# EAGLE design 6809 (EAGLE 7.4.0)

## Sheet 1 of 2
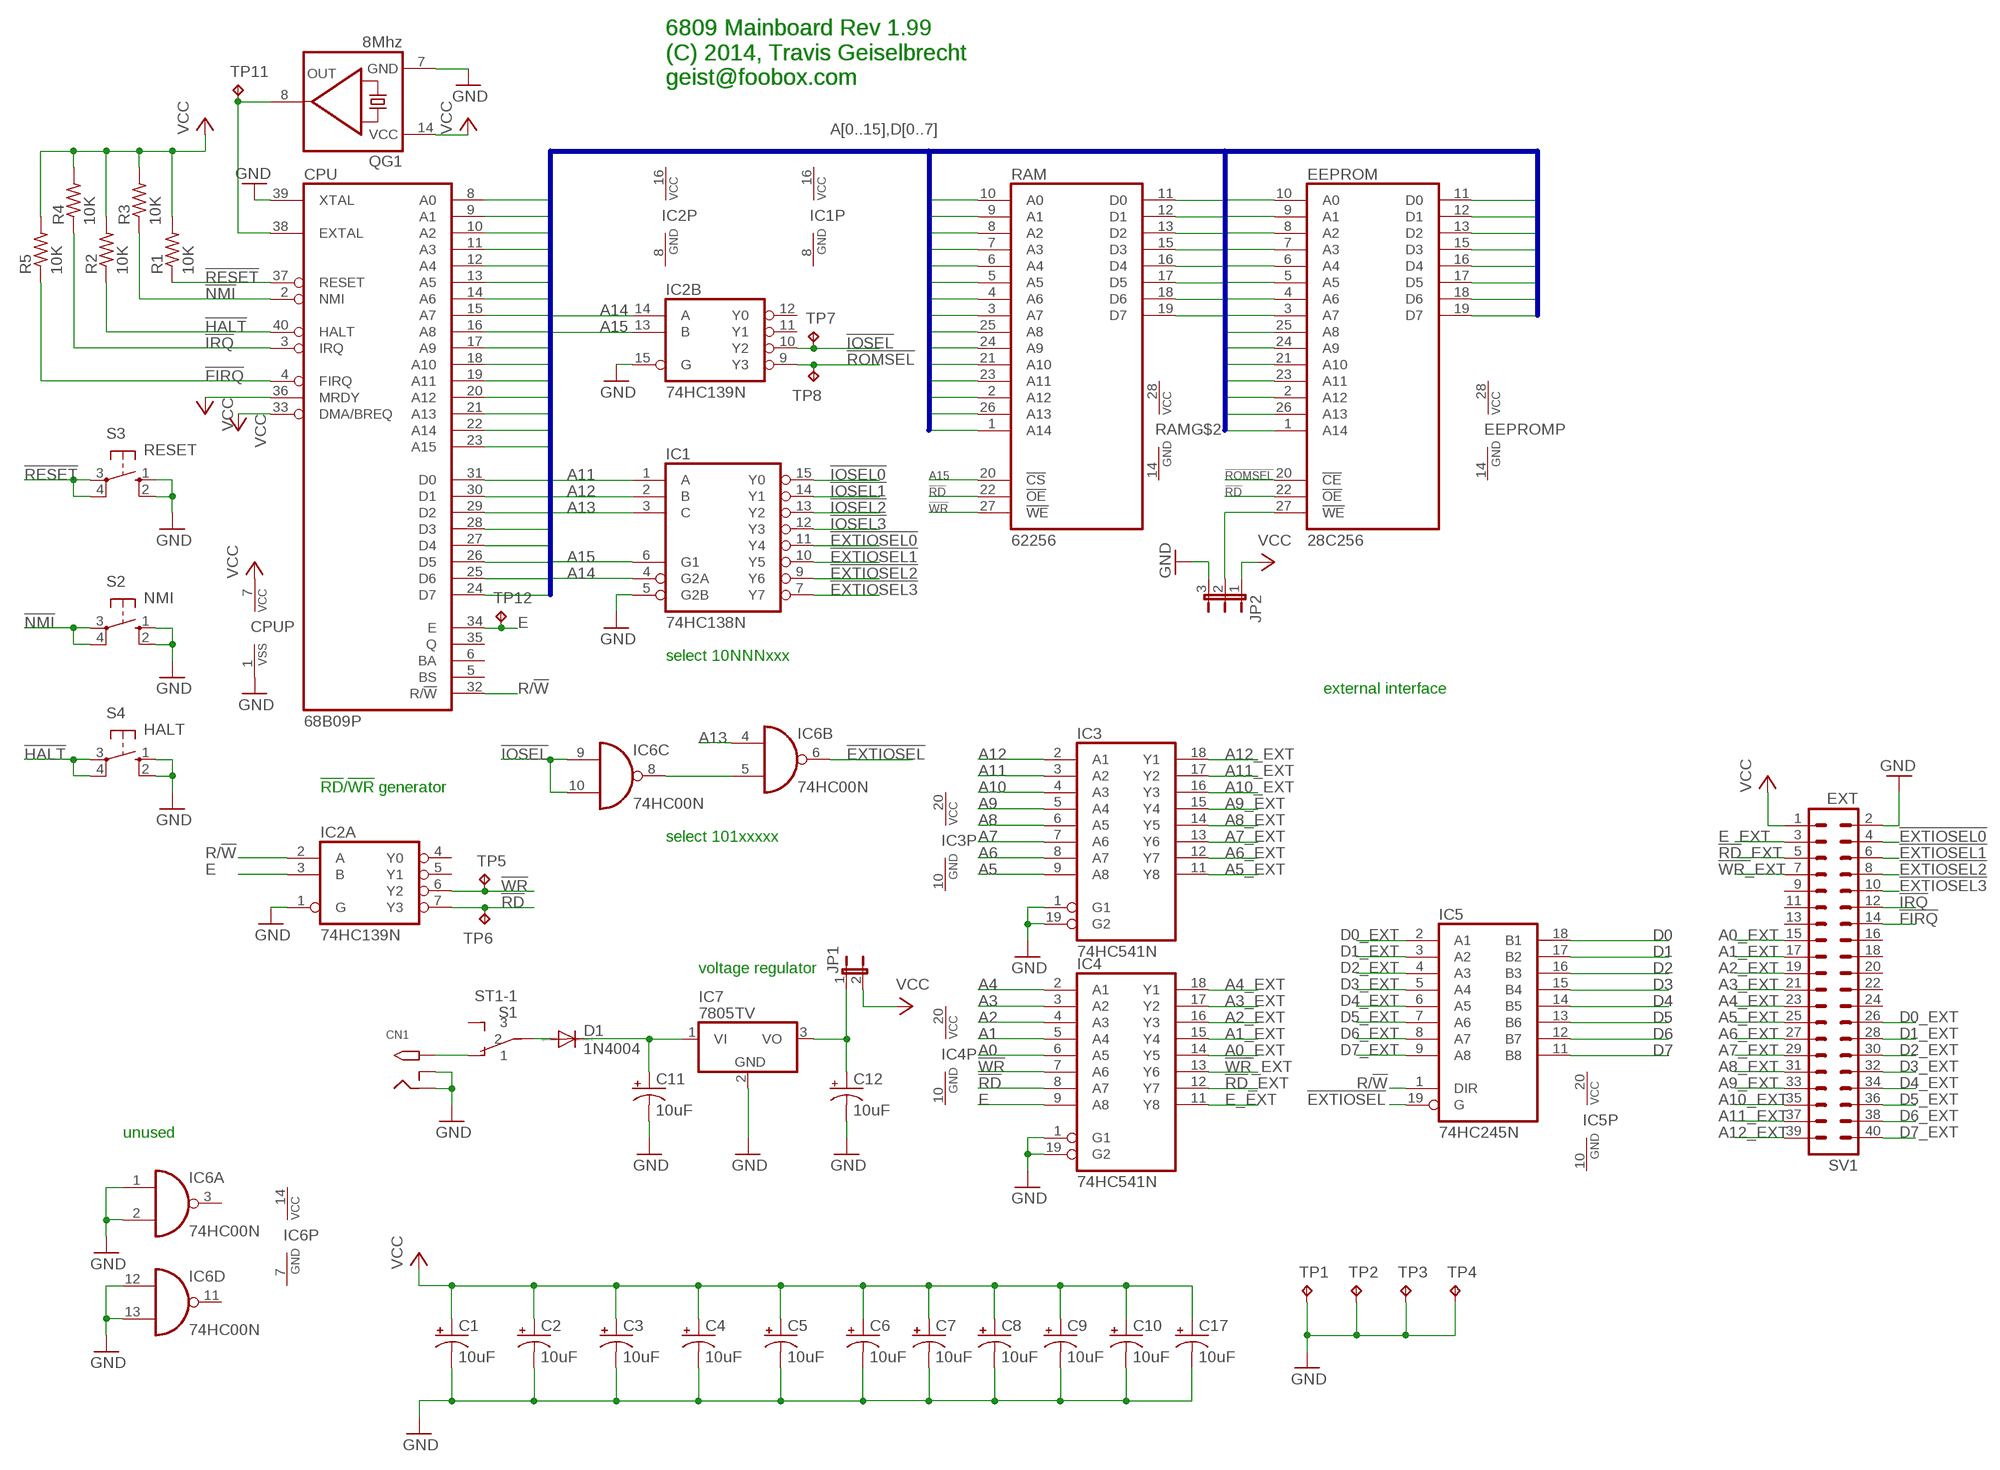
[diagram p0: schematic, sheet 1]

### Parts
C1  10uF  CPOL-USE1.8-4  [E1,8-4]
C2  10uF  CPOL-USE1.8-4  [E1,8-4]
C3  10uF  CPOL-USE1.8-4  [E1,8-4]
C4  10uF  CPOL-USE1.8-4  [E1,8-4]
C5  10uF  CPOL-USE1.8-4  [E1,8-4]
C6  10uF  CPOL-USE1.8-4  [E1,8-4]
C7  10uF  CPOL-USE1.8-4  [E1,8-4]
C8  10uF  CPOL-USE1.8-4  [E1,8-4]
C9  10uF  CPOL-USE1.8-4  [E1,8-4]
C10  10uF  CPOL-USE1.8-4  [E1,8-4]
C11  10uF  CPOL-USE1.8-4  [E1,8-4]
C12  10uF  CPOL-USE1.8-4  [E1,8-4]
C17  10uF  CPOL-USE1.8-4  [E1,8-4]
CN1  2.1MMJACKTHM  [PJ-102A]
CPU  68B09P  6809  [DIL40]
D1  1N4004  [DO41-10]
EEPROM  28C256  [DIL28]
IC1  74HC138N  [DIL16]
IC2  74HC139N  [DIL16]
IC3  74HC541N  [DIL20]
IC4  74HC541N  [DIL20]
IC5  74HC245N  [DIL20]
IC6  74HC00N  [DIL14]
IC7  7805TV  [TO220V]
JP1  JP1E  [JP1]
JP2  JP2E  [JP2]
QG1  8Mhz  QG5860  [DIL14S]
R1  10K  R-US_0207/10  [0207/10]
R2  10K  R-US_0207/10  [0207/10]
R3  10K  R-US_0207/10  [0207/10]
R4  10K  R-US_0207/10  [0207/10]
R5  10K  R-US_0207/10  [0207/10]
RAM  62256  [DIL28]
S1  ST1-1  [ST1-1]
S2  NMI  10-XX  [B3F-10XX]
S3  RESET  10-XX  [B3F-10XX]
S4  HALT  10-XX  [B3F-10XX]
SV1  EXT  MA20-2  [MA20-2]
TP1  TPPAD1-13  [P1-13]
TP2  TPPAD1-13  [P1-13]
TP3  TPPAD1-13  [P1-13]
TP4  TPPAD1-13  [P1-13]
TP5  TPTP10R  [TP10R]
TP6  TPTP10R  [TP10R]
TP7  TPTP10R  [TP10R]
TP8  TPTP10R  [TP10R]
TP11  TPTP10R  [TP10R]
TP12  TPTP10R  [TP10R]

### Nets
!EXTIOSEL: IC5.19(G) IC6.6(B:O)
!EXTIOSEL0: IC1.11(Y4) SV1.4
!EXTIOSEL1: IC1.10(Y5) SV1.6
!EXTIOSEL2: IC1.9(Y6) SV1.8
!EXTIOSEL3: IC1.7(Y7) SV1.10
!FIRQ: CPU.4(FIRQ) R5.1 SV1.14
!HALT: CPU.40(HALT) R2.1 S4.3(P) S4.4(P1)
!IOSEL: IC2.10(B:Y2) IC6.9(C:I0) IC6.10(C:I1) TP7.TP
!IOSEL0: IC1.15(Y0) ; also sheet 2
!IOSEL1: IC1.14(Y1)
!IOSEL2: IC1.13(Y2)
!IOSEL3: IC1.12(Y3)
!IRQ: CPU.3(IRQ) R4.1 SV1.12 ; also sheet 2
!NMI: CPU.2(NMI) R3.1 S2.3(P) S2.4(P1)
!RD: EEPROM.22(!OE) IC2.7(A:Y3) IC4.8(A7) RAM.22(!OE) TP6.TP ; also sheet 2
!RD!_EXT: IC4.12(Y7) SV1.5
!RESET: CPU.37(RESET) R1.1 S3.3(P) S3.4(P1)
!ROMSEL: EEPROM.20(!CE) IC2.9(B:Y3) TP8.TP
!WR: IC2.6(A:Y2) IC4.7(A6) RAM.27(!WE) TP5.TP ; also sheet 2
!WR!_EXT: IC4.13(Y6) SV1.7
A0: CPU.8(A0) EEPROM.10(A0) IC4.6(A5) RAM.10(A0) ; also sheet 2
A0_EXT: IC4.14(Y5) SV1.15
A1: CPU.9(A1) EEPROM.9(A1) IC4.5(A4) RAM.9(A1) ; also sheet 2
A1_EXT: IC4.15(Y4) SV1.17
A2: CPU.10(A2) EEPROM.8(A2) IC4.4(A3) RAM.8(A2) ; also sheet 2
A2_EXT: IC4.16(Y3) SV1.19
A3: CPU.11(A3) EEPROM.7(A3) IC4.3(A2) RAM.7(A3)
A3_EXT: IC4.17(Y2) SV1.21
A4: CPU.12(A4) EEPROM.6(A4) IC4.2(A1) RAM.6(A4)
A4_EXT: IC4.18(Y1) SV1.23
A5: CPU.13(A5) EEPROM.5(A5) IC3.9(A8) RAM.5(A5)
A5_EXT: IC3.11(Y8) SV1.25
A6: CPU.14(A6) EEPROM.4(A6) IC3.8(A7) RAM.4(A6)
A6_EXT: IC3.12(Y7) SV1.27
A7: CPU.15(A7) EEPROM.3(A7) IC3.7(A6) RAM.3(A7)
A7_EXT: IC3.13(Y6) SV1.29
A8: CPU.16(A8) EEPROM.25(A8) IC3.6(A5) RAM.25(A8)
A8_EXT: IC3.14(Y5) SV1.31
A9: CPU.17(A9) EEPROM.24(A9) IC3.5(A4) RAM.24(A9)
A9_EXT: IC3.15(Y4) SV1.33
A10: CPU.18(A10) EEPROM.21(A10) IC3.4(A3) RAM.21(A10)
A10_EXT: IC3.16(Y3) SV1.35
A11: CPU.19(A11) EEPROM.23(A11) IC1.1(A) IC3.3(A2) RAM.23(A11)
A11_EXT: IC3.17(Y2) SV1.37
A12: CPU.20(A12) EEPROM.2(A12) IC1.2(B) IC3.2(A1) RAM.2(A12)
A12_EXT: IC3.18(Y1) SV1.39
A13: CPU.21(A13) EEPROM.26(A13) IC1.3(C) IC6.4(B:I0) RAM.26(A13)
A14: CPU.22(A14) EEPROM.1(A14) IC1.4(G2A) IC2.14(B:A) RAM.1(A14)
A15: CPU.23(A15) IC1.6(G1) IC2.13(B:B) RAM.20(!CS)
D0: CPU.31(D0) EEPROM.11(D0) IC5.18(B1) RAM.11(D0) ; also sheet 2
D0_EXT: IC5.2(A1) SV1.26
D1: CPU.30(D1) EEPROM.12(D1) IC5.17(B2) RAM.12(D1) ; also sheet 2
D1_EXT: IC5.3(A2) SV1.28
D2: CPU.29(D2) EEPROM.13(D2) IC5.16(B3) RAM.13(D2) ; also sheet 2
D2_EXT: IC5.4(A3) SV1.30
D3: CPU.28(D3) EEPROM.15(D3) IC5.15(B4) RAM.15(D3) ; also sheet 2
D3_EXT: IC5.5(A4) SV1.32
D4: CPU.27(D4) EEPROM.16(D4) IC5.14(B5) RAM.16(D4) ; also sheet 2
D4_EXT: IC5.6(A5) SV1.34
D5: CPU.26(D5) EEPROM.17(D5) IC5.13(B6) RAM.17(D5) ; also sheet 2
D5_EXT: IC5.7(A6) SV1.36
D6: CPU.25(D6) EEPROM.18(D6) IC5.12(B7) RAM.18(D6) ; also sheet 2
D6_EXT: IC5.8(A7) SV1.38
D7: CPU.24(D7) EEPROM.19(D7) IC5.11(B8) RAM.19(D7) ; also sheet 2
D7_EXT: IC5.9(A8) SV1.40
E: CPU.34(E) IC2.3(A:B) IC4.9(A8) TP12.TP
E_EXT: IC4.11(Y8) SV1.3
GND [power]: C1.- C2.- C3.- C4.- C5.- C6.- C7.- C8.- C9.- C10.- C11.- C12.- C17.- CN1.RING CN1.RING_SW CPU.1(VSS) CPU.39(XTAL) IC1.5(G2B) IC2.1(A:G) IC2.15(B:G) IC3.1(G1) IC3.19(G2) IC4.1(G1) IC4.19(G2) IC6.1(A:I0) IC6.2(A:I1) IC6.12(D:I0) IC6.13(D:I1) IC7.2(GND) JP2.3 QG1.7(GND) S2.1(S) S2.2(S1) S3.1(S) S3.2(S1) S4.1(S) S4.2(S1) SV1.2 TP1.TP TP2.TP TP3.TP TP4.TP ; also sheet 2
N$3: C11.+ D1.C IC7.1(VI)
N$4: IC6.5(B:I1) IC6.8(C:O)
N$5: CN1.TIP S1.P$1
N$13: CPU.38(EXTAL) QG1.8(OUT) TP11.TP
N$15: D1.A S1.P$2
N$25: EEPROM.27(!WE) JP2.2
N$26: C12.+ IC7.3(VO) JP1.1
R/!W: CPU.32(R/!W) IC2.2(A:A) IC5.1(DIR)
VCC [power]: C1.+ C2.+ C3.+ C4.+ C5.+ C6.+ C7.+ C8.+ C9.+ C10.+ C17.+ CPU.7(VCC) CPU.33(DMA/BREQ) CPU.36(MRDY) JP1.2 JP2.1 QG1.14(VCC) R1.2 R2.2 R3.2 R4.2 R5.2 SV1.1 ; also sheet 2
Unconnected: CPU.5(BS) CPU.6(BA) CPU.35(Q) IC2.4(A:Y0) IC2.5(A:Y1) IC2.11(B:Y1) IC2.12(B:Y0) IC6.3(A:O) IC6.11(D:O) S1.P$3 SV1.9 SV1.11 SV1.13 SV1.16 SV1.18 SV1.20 SV1.22 SV1.24

### Buses
A[0..15],D[0..7]

### Notes on the sheet
- 6809 Mainboard Rev 1.99
  (C) 2014, Travis Geiselbrecht
  geist@foobox.com
- 6809 Mainboard Rev 1
  (C) 2014, Travis Geiselbrecht
  geist@foobox.com
- select 10NNNxxx
- external interface
- !RD!/!WR! generator
- select 101xxxxx
- voltage regulator
- unused

## Sheet 2 of 2
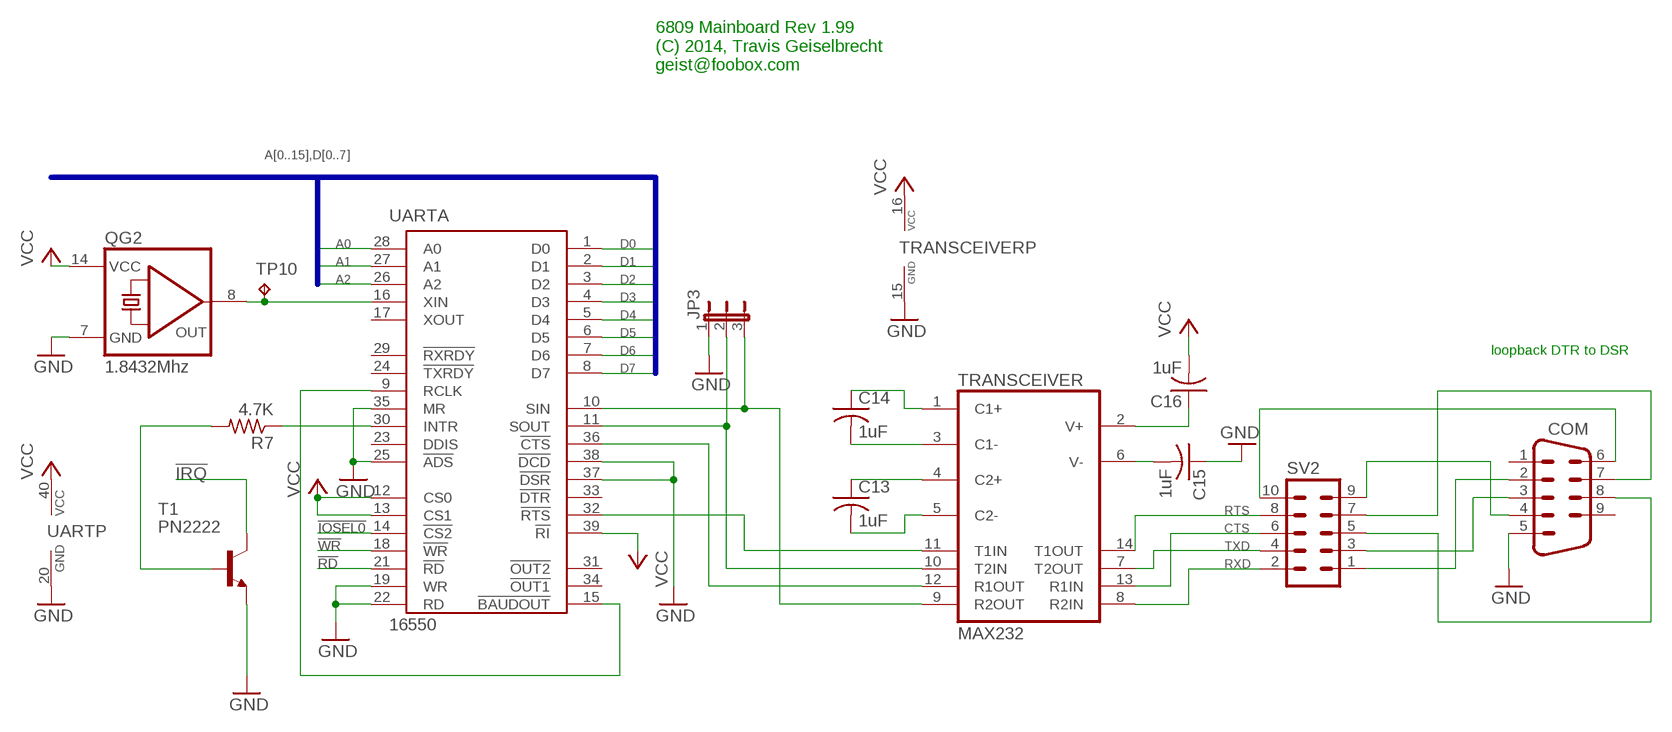
[diagram p1: schematic, sheet 2]

### Parts
C13  1uF  C-US025-025X050  [C025-025X050]
C14  1uF  C-US025-025X050  [C025-025X050]
C15  1uF  C-US025-025X050  [C025-025X050]
C16  1uF  C-US025-025X050  [C025-025X050]
COM  M09HP  [M09HP]
JP3  JP2E  [JP2]
QG2  1.8432Mhz  QG5860  [DIL14S]
R7  4.7K  R-US_0207/10  [0207/10]
SV2  MA05-2  [MA05-2]
T1  PN2222  2N2222  [TO92-EBC-OVAL]
TP10  TPTP10R  [TP10R]
TRANSCEIVER  MAX232  [DIL16]
UART  16550  [DIL40]

### Nets
!IOSEL0: UART.14(A:!CS2) ; also sheet 1
!IRQ: T1.C ; also sheet 1
!RD: UART.21(A:!RD) ; also sheet 1
!WR: UART.18(A:!WR) ; also sheet 1
A0: UART.28(A:A0) ; also sheet 1
A1: UART.27(A:A1) ; also sheet 1
A2: UART.26(A:A2) ; also sheet 1
CTS: SV2.6 TRANSCEIVER.13(R1IN)
D0: UART.1(A:D0) ; also sheet 1
D1: UART.2(A:D1) ; also sheet 1
D2: UART.3(A:D2) ; also sheet 1
D3: UART.4(A:D3) ; also sheet 1
D4: UART.5(A:D4) ; also sheet 1
D5: UART.6(A:D5) ; also sheet 1
D6: UART.7(A:D6) ; also sheet 1
D7: UART.8(A:D7) ; also sheet 1
GND [power]: C15.1 COM.5 JP3.1 QG2.7(GND) T1.E TRANSCEIVER.15(GND) UART.19(A:WR) UART.20(P:GND) UART.22(A:RD) UART.25(A:!ADS) UART.35(A:MR) UART.37(A:!DSR) UART.38(A:!DCD) ; also sheet 1
N$1: QG2.8(OUT) TP10.TP UART.16(A:XIN)
N$2: TRANSCEIVER.11(T1IN) UART.32(A:!RTS)
N$6: JP3.2 TRANSCEIVER.10(T2IN) UART.11(A:SOUT)
N$7: TRANSCEIVER.12(R1OUT) UART.36(A:!CTS)
N$8: COM.4 SV2.9
N$9: C14.1 TRANSCEIVER.1(C1+)
N$10: C14.2 TRANSCEIVER.3(C1-)
N$11: JP3.3 TRANSCEIVER.9(R2OUT) UART.10(A:SIN)
N$12: C13.1 TRANSCEIVER.4(C2+)
N$14: C13.2 TRANSCEIVER.5(C2-)
N$16: COM.2 SV2.1
N$17: COM.8 SV2.5
N$18: COM.7 SV2.7
N$19: C16.1 TRANSCEIVER.2(V+)
N$20: COM.3 SV2.3
N$21: C15.2 TRANSCEIVER.6(V-)
N$22: R7.2 T1.B
N$23: R7.1 UART.30(A:INTR)
N$24: COM.6 SV2.10
N$27: UART.9(A:RCLK) UART.15(A:!BAUDOUT)
RTS: SV2.8 TRANSCEIVER.14(T1OUT)
RXD: SV2.2 TRANSCEIVER.8(R2IN)
TXD: SV2.4 TRANSCEIVER.7(T2OUT)
VCC [power]: C16.2 QG2.14(VCC) TRANSCEIVER.16(VCC) UART.12(A:CS0) UART.13(A:CS1) UART.39(A:!RI) UART.40(P:VCC) ; also sheet 1
Unconnected: COM.1 COM.9 UART.17(A:XOUT) UART.23(A:DDIS) UART.24(A:!TXRDY) UART.29(A:!RXRDY) UART.31(A:!OUT2) UART.33(A:!DTR) UART.34(A:!OUT1)

### Buses
A[0..15],D[0..7]

### Notes on the sheet
- 6809 Mainboard Rev 1.99
  (C) 2014, Travis Geiselbrecht
  geist@foobox.com
- loopback DTR to DSR

## Power pins joined to a net without a drawn wire
GND: EEPROM.14(GND) IC1.8(GND) IC2.8(P:GND) IC3.10(GND) IC4.10(GND) IC5.10(GND) IC6.7(P:GND) RAM.14(GND)
VCC: EEPROM.28(VCC) IC1.16(VCC) IC2.16(P:VCC) IC3.20(VCC) IC4.20(VCC) IC5.20(VCC) IC6.14(P:VCC) RAM.28(VCC)

## Library data of the parts
C1-C12 C17 = adafruit:CPOL-US: POLARIZED CAPACITOR, American symbol
C13-C16 = resistor:C-US: CAPACITOR, American symbol
CN1 = adafruit:2.1MMJACK: 2.1mm x 5.5mm THM DC jack with internal switch. Digikey part #PJ-102A, 4UCON part #05537 2.1mm x 5.5mm SMT DC jack with internal switch. Digikey part #PJ-002A-SMT, 4UCON part #03267 By microbuilder.eu & adafruit.com
COM = con-subd:M09: SUB-D; OC_FARNELL: unknown; OC_NEWARK: unknown
CPU = micro-motorola:6809: MICROCONTROLLER/MEMORY DEVICE; MF: NTE ELECTRONICS; MPN: NTE6809; OC_FARNELL: 4530354; OC_NEWARK: 31C2459
D1 = diode:1N4004: DIODE general purpose rectifier, 1 A
EEPROM = mystuff:28C256: 8K x 8 EEPROM
IC1 = 74xx-eu:74*138: 3-line to 8-line DECODER/DEMULTIPLEXER
IC2 = 74xx-eu:74*139: Dual 2-line to 4-line DECODER/DEMULTIPLEXER
IC3 IC4 = 74xx-eu:74*541: Octal BUFFER and LINE DRIVER, 3-state
IC5 = 74xx-eu:74*245: Octal BUS TRANSCEIVER, 3-state
IC6 = 74xx-eu:74*00: Quad 2-input NAND gate
IC7 = linear:78*: Positive VOLTAGE REGULATOR Source: http://cache.national.com/ds/LM/LM78L05.pdf http://www.fairchildsemi.com/ds/LM/LM7805.pdf
JP1 = jumper:JP1E: JUMPER
JP2 JP3 = jumper:JP2E: JUMPER
QG1 QG2 = crystal:QG5860: CRYSTAL RESONATOR; OC_FARNELL: unknown; OC_NEWARK: unknown
R1-R5 R7 = resistor:R-US_: RESISTOR, American symbol
RAM = mystuff:62256: 32KB sram
S1 = mystuff:ST1-1
S2-S4 = switch-omron:10-XX: OMRON SWITCH; MPN: B3F-1000; OC_FARNELL: 176432; OC_NEWARK: 36M3542
SV1 = con-lstb:MA20-2: PIN HEADER; OC_FARNELL: unknown; OC_NEWARK: unknown
SV2 = con-lstb:MA05-2: PIN HEADER; OC_FARNELL: unknown; OC_NEWARK: unknown
T1 = adafruit:2N2222: NPN TRANSISTOR Big oval pads
TP1-TP8 TP10-TP12 = testpad:TP: Test pad
TRANSCEIVER = maxim:MAX232: RS232 TRANSCEIVER; MF: MAXIM; MPN: MAX232ACPE+; OC_FARNELL: 9723773; OC_NEWARK: 68K4544
UART = mystuff:16550

## Net classes
0 default: width 0.406 mm
1 power: width 1.016 mm

## Board
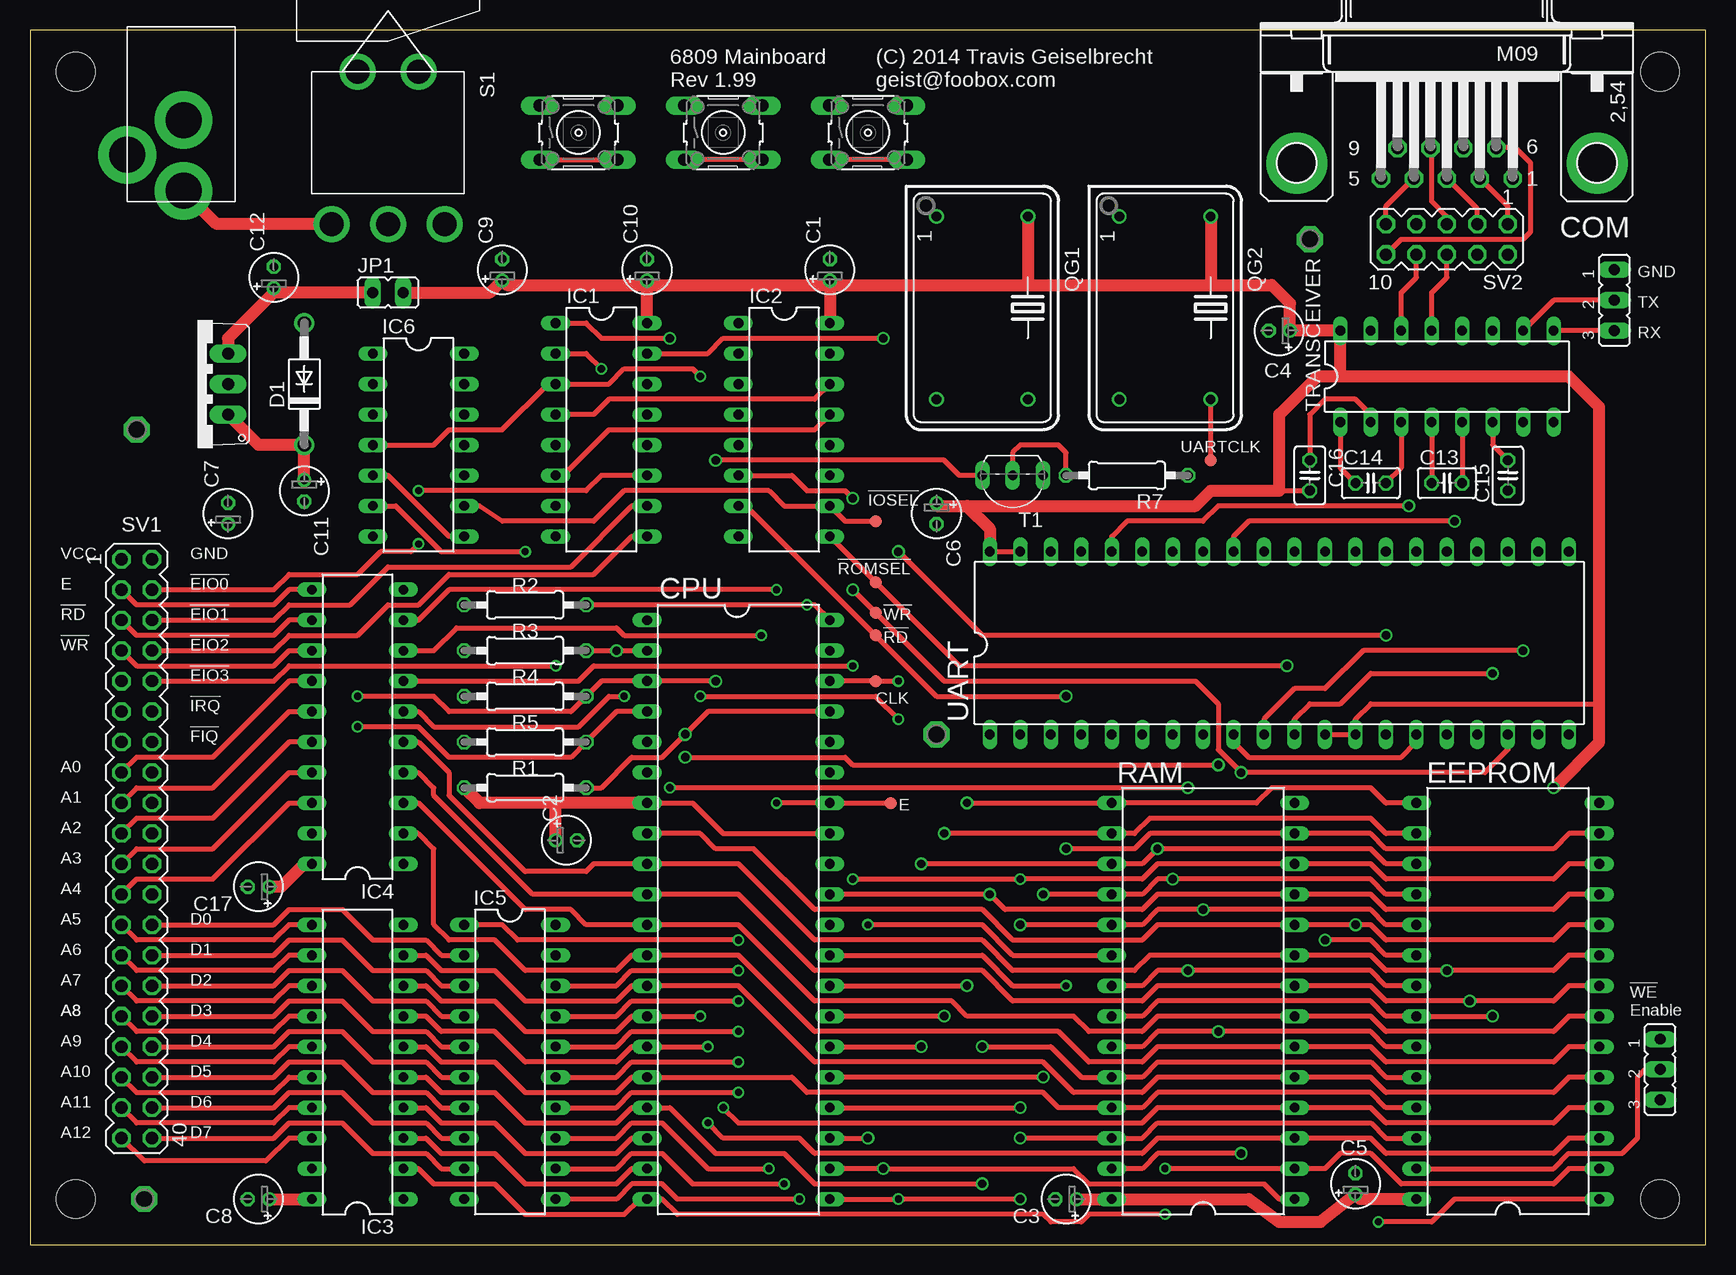
[diagram p2: board, top side]
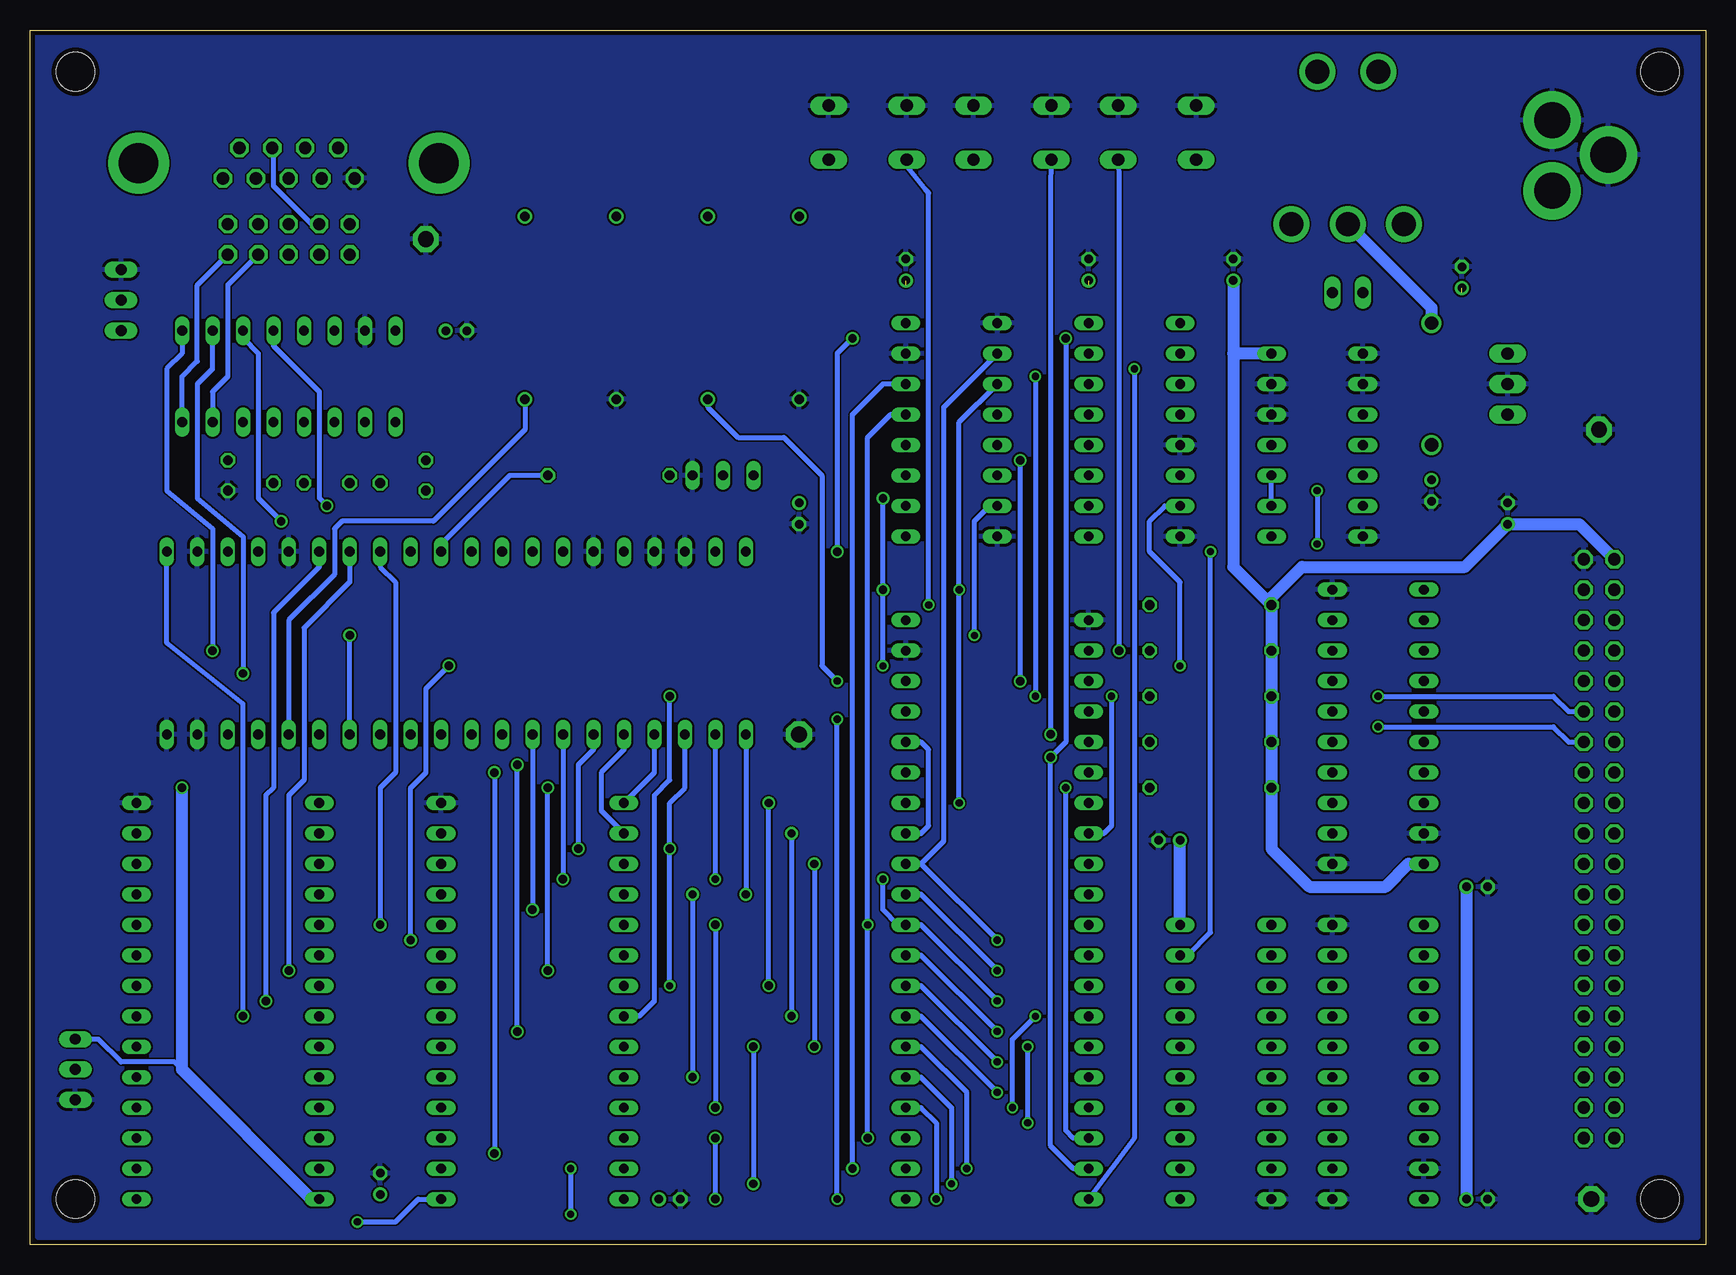
[diagram p3: board, bottom side, seen from below]

Size 139.68 x 101.27 mm. Coordinates in mm from the lower left corner, seen from the top.
Outline: 0,0 139.68,0 139.68,101.27 0,101.27 0,0
Copper layers (1*16): Top 0.0356mm / dielectric 1.5011mm / Bottom 0.0356mm
Design rules "oshpark": minimum track width 6mil, minimum drill 13mil, track to track 6mil, track to pad 6mil, pad to pad 6mil, via to via 6mil, smd to smd 6mil, copper to edge 15mil, drill to drill 6mil, minimum pad ring 7mil, minimum via ring 7mil, stop-mask expansion 3mil, vias tented up to drill 0mil, thermal gap 10mil
Holes 3.2 mm at 135.89,97.79 3.81,97.79 135.89,3.81 3.81,3.81

### Footprints (pad centres in the part's own frame; a part is rotated, then mirrored left to right if it is on the bottom)
E1,8-4 = drill 0.711 pad 1.168: + -0.889,0 | drill 0.711 pad 1.168 octagon: - 0.889,0
C025-025X050 = drill 0.813 octagon: 1 -1.27,0; 2 1.27,0
PJ-102A = drill 3 pad 4.8: RING 0.1,-3.39; RING_SW -4.6,-6.29; TIP 0.1,-9.29
M09HP = drill 1.016 octagon: 1 -5.486,1.27; 2 -2.743,1.27; 3 0,1.27; 4 2.743,1.27; 5 5.486,1.27; 6 -4.115,-1.27; 7 -1.372,-1.27; 8 1.372,-1.27; 9 4.115,-1.27 | drill 3.302 pad 5.08: G1 -12.522,0; G2 12.522,0
DIL40 = drill 0.813 long: 1 -24.13,-7.62; 2 -21.59,-7.62; 3 -19.05,-7.62; 4 -16.51,-7.62; 5 -13.97,-7.62; 6 -11.43,-7.62; 7 -8.89,-7.62; 8 -6.35,-7.62; 9 -3.81,-7.62; 10 -1.27,-7.62; 11 1.27,-7.62; 12 3.81,-7.62; 13 6.35,-7.62; 14 8.89,-7.62; 15 11.43,-7.62; 16 13.97,-7.62; 17 16.51,-7.62; 18 19.05,-7.62; 19 21.59,-7.62; 20 24.13,-7.62; 21 24.13,7.62; 22 21.59,7.62; 23 19.05,7.62; 24 16.51,7.62; 25 13.97,7.62; 26 11.43,7.62; 27 8.89,7.62; 28 6.35,7.62; 29 3.81,7.62; 30 1.27,7.62; 31 -1.27,7.62; 32 -3.81,7.62; 33 -6.35,7.62; 34 -8.89,7.62; 35 -11.43,7.62; 36 -13.97,7.62; 37 -16.51,7.62; 38 -19.05,7.62; 39 -21.59,7.62; 40 -24.13,7.62
DO41-10 = drill 1.118: A 5.08,0; C -5.08,0
DIL28 = drill 0.813 long: 1 -16.51,-7.62; 2 -13.97,-7.62; 3 -11.43,-7.62; 4 -8.89,-7.62; 5 -6.35,-7.62; 6 -3.81,-7.62; 7 -1.27,-7.62; 8 1.27,-7.62; 9 3.81,-7.62; 10 6.35,-7.62; 11 8.89,-7.62; 12 11.43,-7.62; 13 13.97,-7.62; 14 16.51,-7.62; 15 16.51,7.62; 16 13.97,7.62; 17 11.43,7.62; 18 8.89,7.62; 19 6.35,7.62; 20 3.81,7.62; 21 1.27,7.62; 22 -1.27,7.62; 23 -3.81,7.62; 24 -6.35,7.62; 25 -8.89,7.62; 26 -11.43,7.62; 27 -13.97,7.62; 28 -16.51,7.62
DIL16 = drill 0.813 long: 1 -8.89,-3.81; 2 -6.35,-3.81; 3 -3.81,-3.81; 4 -1.27,-3.81; 5 1.27,-3.81; 6 3.81,-3.81; 7 6.35,-3.81; 8 8.89,-3.81; 9 8.89,3.81; 10 6.35,3.81; 11 3.81,3.81; 12 1.27,3.81; 13 -1.27,3.81; 14 -3.81,3.81; 15 -6.35,3.81; 16 -8.89,3.81
DIL20 = drill 0.813 long: 1 -11.43,-3.81; 2 -8.89,-3.81; 3 -6.35,-3.81; 4 -3.81,-3.81; 5 -1.27,-3.81; 6 1.27,-3.81; 7 3.81,-3.81; 8 6.35,-3.81; 9 8.89,-3.81; 10 11.43,-3.81; 11 11.43,3.81; 12 8.89,3.81; 13 6.35,3.81; 14 3.81,3.81; 15 1.27,3.81; 16 -1.27,3.81; 17 -3.81,3.81; 18 -6.35,3.81; 19 -8.89,3.81; 20 -11.43,3.81
DIL14 = drill 0.813 long: 1 -7.62,-3.81; 2 -5.08,-3.81; 3 -2.54,-3.81; 4 0,-3.81; 5 2.54,-3.81; 6 5.08,-3.81; 7 7.62,-3.81; 8 7.62,3.81; 9 5.08,3.81; 10 2.54,3.81; 11 0,3.81; 12 -2.54,3.81; 13 -5.08,3.81; 14 -7.62,3.81
TO220V = drill 1.016 long: 1 -2.54,-2.54; 2 0,-2.54; 3 2.54,-2.54
JP1 = drill 0.914 long: 1 0,-1.27; 2 0,1.27
JP2 = drill 0.914 long: 1 -2.54,0; 2 0,0; 3 2.54,0
DIL14S = drill 0.813: 1 -7.62,-3.81; 7 7.62,-3.81; 8 7.62,3.81; 14 -7.62,3.81
0207/10 = drill 0.813 octagon: 1 -5.08,0; 2 5.08,0
ST1-1 = drill 2: P$1 0,-4.699; P$2 0,0; P$3 0,4.699; P$4 -12.7,2.54; P$5 -12.7,-2.54
B3F-10XX = drill 1.016 long: 1 -3.251,2.261; 2 3.251,2.261; 3 -3.251,-2.261; 4 3.251,-2.261
MA20-2 = drill 1.016 octagon: 1 -24.13,-1.27; 2 -24.13,1.27; 3 -21.59,-1.27; 4 -21.59,1.27; 5 -19.05,-1.27; 6 -19.05,1.27; 7 -16.51,-1.27; 8 -16.51,1.27; 9 -13.97,-1.27; 10 -13.97,1.27; 11 -11.43,-1.27; 12 -11.43,1.27; 13 -8.89,-1.27; 14 -8.89,1.27; 15 -6.35,-1.27; 16 -6.35,1.27; 17 -3.81,-1.27; 18 -3.81,1.27; 19 -1.27,-1.27; 20 -1.27,1.27; 21 1.27,-1.27; 22 1.27,1.27; 23 3.81,-1.27; 24 3.81,1.27; 25 6.35,-1.27; 26 6.35,1.27; 27 8.89,-1.27; 28 8.89,1.27; 29 11.43,-1.27; 30 11.43,1.27; 31 13.97,-1.27; 32 13.97,1.27; 33 16.51,-1.27; 34 16.51,1.27; 35 19.05,-1.27; 36 19.05,1.27; 37 21.59,-1.27; 38 21.59,1.27; 39 24.13,-1.27; 40 24.13,1.27
MA05-2 = drill 1.016 octagon: 1 -5.08,-1.27; 2 -5.08,1.27; 3 -2.54,-1.27; 4 -2.54,1.27; 5 0,-1.27; 6 0,1.27; 7 2.54,-1.27; 8 2.54,1.27; 9 5.08,-1.27; 10 5.08,1.27
TO92-EBC-OVAL = drill 0.813 long: B 0,-1.27; C 2.54,-1.27; E -2.54,-1.27
P1-13 = drill 1.321 pad 2.159 octagon: TP 0,0
TP10R = smd 1 x 1: TP 0,0

### Placement (x,y rotation side)
C1  66.67,81.28 90 top
C2  44.71,33.73 0 top
C3  86.36,3.81 180 top
C4  104.14,76.2 180 top
C5  110.49,5.08 90 top
C6  75.56,60.96 270 top
C7  16.51,60.96 90 top
C8  19.05,3.81 180 top
C9  39.37,81.28 90 top
C10  51.44,81.28 90 top
C11  22.86,62.87 270 top
C12  20.32,80.64 90 top
C13  118.11,63.5 0 top
C14  111.76,63.5 0 top
C15  123.19,64.14 90 top
C16  106.68,64.14 270 top
C17  19.05,29.84 180 top
CN1  12.7,97.16 0 top
COM  118.11,90.17 180 top
CPU  59.05,27.94 270 top
D1  22.86,71.75 90 top
EEPROM  123.19,20.32 90 top
IC1  47.62,67.94 270 top
IC2  62.87,67.94 270 top
IC3  27.3,15.24 90 top
IC4  27.3,43.18 90 top
IC5  40.01,15.24 270 top
IC6  32.38,66.67 270 top
IC7  13.97,71.75 90 top
JP1  29.84,79.38 270 top
JP2  135.89,14.61 270 top
JP3  132.08,78.74 270 top
QG1  79.38,78.11 270 top
QG2  94.61,78.11 270 top
R1  41.27,38.1 180 top
R2  41.27,53.34 180 top
R3  41.27,49.53 180 top
R4  41.27,45.72 180 top
R5  41.27,41.91 180 top
R7  91.44,64.14 180 top
RAM  97.79,20.32 90 top
S1  29.84,85.09 270 top
S2  45.72,92.71 0 top
S3  57.78,92.71 0 top
S4  69.85,92.71 0 top
SV1  8.89,33.02 270 top
SV2  118.11,83.82 180 top
T1  81.92,62.87 180 top
TP1  8.89,67.94 0 top
TP2  9.53,3.81 0 top
TP3  75.56,42.55 0 top
TP4  106.68,83.82 0 top
TP5  70.48,52.7 0 top
TP6  70.48,50.8 0 top
TP7  70.48,60.33 0 top
TP8  70.48,55.24 0 top
TP10  98.42,65.41 0 top
TP11  70.48,46.99 0 top
TP12  71.75,36.83 0 top
TRANSCEIVER  118.11,72.39 0 top
UART  104.14,50.16 0 top

### Tracks (layer width: path | path; a pad name or v marks a point on that pad's centre or on a via)
!EXTIOSEL  (via drill 0.6)
  Top 0.406: IC6.6 30.48,61.59 34.29,57.78 v41.27,57.78
  Bottom 0.406: IC5.19 43.18,24.13 41.27,26.04 v41.27,57.78
!EXTIOSEL0  (via drill 0.6)
  Top 0.406: SV1.4 20.32,54.61 21.59,55.88 27.3,55.88 29.21,57.78 31.75,57.78 v32.38,58.42 | IC1.11 47.62,64.14 46.35,62.87 v32.38,62.87
  Bottom 0.406: v32.38,62.87 v32.38,58.42
!EXTIOSEL1
  Top 0.406: SV1.6 20.32,52.07 21.59,53.34 26.67,53.34 29.84,56.52 45.09,56.52 50.16,61.59 IC1.10
!EXTIOSEL2
  Top 0.406: SV1.8 20.32,49.53 21.59,50.8 27.3,50.8 29.84,53.34 32.38,53.34 34.92,55.88 46.99,55.88 50.16,59.05 IC1.9
!EXTIOSEL3  (via drill 0.6)
  Top 0.406: SV1.10 20.32,46.99 21.59,48.26 v43.81,48.26
  Bottom 0.406: v43.81,48.26 43.81,55.24 46.35,57.78 46.35,60.33 45.09,61.59 IC1.7
!FIRQ  (via drill 0.6)
  Top 0.406: CPU.4 48.9,44.45 R5.1 45.09,40.64 34.92,40.64 32.38,43.18 v27.3,43.18
  Bottom 0.406: v27.3,43.18 12.7,43.18 11.43,41.91 SV1.14
!HALT  (via drill 0.6)
  Top 0.406: CPU.40 65.41,53.34 v64.77,53.34 R2.1 | S4.4 S4.3
  Bottom 0.406: S4.3 67.03,90.45 65.02,87.94 | 65.02,87.94 64.77,87.63 | v64.77,53.34 64.77,87.69 65.02,87.94
!IOSEL
  Top 0.406: IC6.9 37.47,61.59 39.37,60.33 46.99,60.33 49.53,62.87 61.59,62.87 62.87,61.59 IC2.10 67.94,60.33 TP7.TP
  Bottom 0.406: IC6.9 IC6.10
!IOSEL0  (via drill 0.7)
  Top 0.406: v113.03,50.8 79.38,50.8 v72.39,57.78 | IC1.15 56.52,74.3 57.78,75.56 v71.12,75.56
  Bottom 0.406: UART.14 v113.03,50.8 | v71.12,75.56 72.39,74.3 v72.39,57.78
!IRQ  (via drill 0.6, 0.7)
  Top 0.406: T1.C 77.47,64.14 76.2,65.41 v57.15,65.41 | v57.15,46.99 CPU.3 47.62,46.99 R4.1 45.09,44.45 34.92,44.45 33.66,45.72 v27.3,45.72
  Bottom 0.406: v57.15,65.41 v57.15,46.99 | v27.3,45.72 12.7,45.72 11.43,44.45 SV1.12
!NMI  (via drill 0.7)
  Top 0.406: R3.1 v48.9,49.53 CPU.2 | S2.3 S2.4
  Bottom 0.406: S2.4 48.97,90.25 48.9,88.9 v48.9,49.53
!RD  (via drill 0.6, 0.7)
  Top 0.406: RAM.22 92.71,19.05 93.98,20.32 111.76,20.32 113.03,19.05 EEPROM.22 v121.92,19.05 | IC2.7 59.69,61.59 TP6.TP 75.56,45.72 v86.36,45.72 | IC4.8 33.66,49.53 35.56,51.44 48.9,51.44 49.53,50.8 v60.96,50.8
  Bottom 0.406: v121.92,19.05 121.92,45.09 128.27,50.16 UART.21 | v86.36,45.72 86.36,38.73 87.63,37.47 87.63,20.32 88.9,19.05 RAM.22 | v60.96,50.8 60.96,60.33 59.69,61.59 IC2.7
!RD!_EXT
  Top 0.406: IC4.12 21.59,52.07 20.32,50.8 8.89,50.8 SV1.5
!RESET  (via drill 0.7)
  Top 0.406: CPU.37 56.52,44.45 v54.61,42.55 52.7,40.64 50.16,40.64 47.62,38.1 R1.1 | S3.4 S3.3
  Bottom 0.406: S3.3 54.53,90.09 54.61,88.9 v54.61,42.55
!ROMSEL  (via drill 0.7)
  Top 0.406: EEPROM.20 113.03,24.13 111.76,25.4 v107.95,25.4 | v104.78,48.26 77.47,48.26 TP8.TP IC2.9
  Bottom 0.406: v107.95,25.4 107.95,38.1 106.68,39.37 106.68,46.35 v104.78,48.26
!WR  (via drill 0.6, 0.7)
  Top 0.406: UART.18 123.19,41.27 121.28,39.37 v100.97,39.37 99.06,41.27 99.06,45.09 97.16,46.99 76.2,46.99 TP5.TP v68.58,54.61 | v100.97,7.62 93.98,7.62 92.71,6.35 RAM.27 | IC2.6 63.5,64.14 64.77,62.87 67.94,62.87 v68.58,62.23 | IC4.7 45.72,46.99 46.99,48.26 v68.58,48.26
  Bottom 0.406: v100.97,39.37 v100.97,7.62 | v68.58,62.23 v68.58,54.61 v68.58,48.26
!WR!_EXT
  Top 0.406: SV1.7 8.89,48.26 20.32,48.26 21.59,49.53 IC4.13
A0  (via drill 0.6, 0.7)
  Top 0.406: EEPROM.10 128.27,26.67 127,25.4 113.03,25.4 111.76,26.67 v110.49,26.67 RAM.10 93.98,26.67 92.71,25.4 81.92,25.4 79.38,27.94 65.41,27.94 60.33,33.02 57.15,33.02 55.88,34.29 CPU.8 | IC4.6 32.38,44.45 33.66,43.18 45.72,43.18 48.26,45.72 v49.53,45.72
  Bottom 0.406: UART.28 110.49,56.52 109.22,55.24 109.22,39.37 110.49,38.1 v110.49,26.67 | v49.53,45.72 49.53,34.92 50.16,34.29 CPU.8
A0_EXT
  Top 0.406: IC4.14 21.59,46.99 15.24,40.64 8.89,40.64 SV1.15
A1  (via drill 0.7)
  Top 0.406: EEPROM.9 128.27,24.13 127,22.86 v118.11,22.86 113.03,22.86 111.76,24.13 RAM.9 93.34,24.13 92.08,22.86 81.92,22.86 79.38,25.4 65.41,25.4 59.05,31.75 CPU.9 46.99,31.75 46.35,31.11 41.27,31.11 34.92,37.47 34.92,39.37 32.38,41.91 IC4.5
  Bottom 0.406: UART.27 113.03,55.24 116.84,51.44 116.84,38.73 118.11,37.47 v118.11,22.86
A1_EXT
  Top 0.406: SV1.17 8.89,38.1 15.24,38.1 21.59,44.45 IC4.15
A2  (via drill 0.7)
  Top 0.406: EEPROM.8 128.27,21.59 127,20.32 v120.02,20.32 113.03,20.32 111.76,21.59 RAM.8 93.98,21.59 92.71,20.32 81.92,20.32 79.38,22.86 65.41,22.86 59.05,29.21 CPU.10 41.91,29.21 33.66,37.47 33.66,38.1 32.38,39.37 IC4.4
  Bottom 0.406: UART.26 115.57,56.52 119.38,52.7 119.38,38.1 120.02,37.47 v120.02,20.32
A2_EXT
  Top 0.406: IC4.16 21.59,41.91 15.24,35.56 8.89,35.56 SV1.19
A3
  Top 0.406: EEPROM.7 128.27,19.05 127,17.78 113.03,17.78 111.76,19.05 RAM.7 93.98,19.05 92.71,17.78 88.27,17.78 87,19.05 78.11,19.05 76.83,20.32 65.41,20.32 59.05,26.67 CPU.11 46.35,26.67 45.09,27.94 41.27,27.94 32.38,36.83 IC4.3
A3_EXT
  Top 0.406: SV1.21 8.89,33.02 15.24,33.02 21.59,39.37 IC4.17
A4
  Top 0.406: EEPROM.6 128.27,16.51 127,15.24 113.03,15.24 111.76,16.51 RAM.6 93.98,16.51 92.71,15.24 88.27,15.24 85.72,17.78 65.41,17.78 59.05,24.13 CPU.12 50.16,24.13 48.9,22.86 41.27,22.86 38.73,25.4 34.92,25.4 33.66,26.67 33.66,33.02 32.38,34.29 IC4.2
A4_EXT
  Top 0.406: SV1.23 8.89,30.48 15.24,30.48 21.59,36.83 IC4.18
A5
  Top 0.406: EEPROM.5 128.27,13.97 127,12.7 113.03,12.7 111.76,13.97 RAM.5 93.98,13.97 92.71,12.7 87,12.7 84.45,15.24 65.41,15.24 59.05,21.59 CPU.13 50.16,21.59 48.9,20.32 41.27,20.32 38.73,22.86 34.29,22.86 33.02,24.13 IC3.9
A5_EXT
  Top 0.406: IC3.11 21.59,26.67 20.32,25.4 8.89,25.4 SV1.25
A6  (via drill 0.6)
  Top 0.406: EEPROM.4 128.27,11.43 127,10.16 113.03,10.16 111.76,11.43 RAM.4 93.98,11.43 92.71,10.16 59.05,10.16 v57.78,11.43 | v55.88,19.05 CPU.14 50.16,19.05 48.9,17.78 41.27,17.78 38.73,20.32 34.29,20.32 33.02,21.59 IC3.8
  Bottom 0.406: v57.78,11.43 57.78,17.14 v55.88,19.05
A6_EXT
  Top 0.406: IC3.12 21.59,24.13 20.32,22.86 8.89,22.86 SV1.27
A7  (via drill 0.6)
  Top 0.406: EEPROM.3 128.27,8.89 127,7.62 113.03,7.62 111.76,8.89 RAM.3 93.98,8.89 92.71,7.62 65.41,7.62 64.14,8.89 57.78,8.89 v56.52,10.16 | v56.52,16.51 CPU.15 50.16,16.51 48.9,15.24 41.27,15.24 38.73,17.78 34.29,17.78 33.02,19.05 IC3.7
  Bottom 0.406: v56.52,16.51 v56.52,10.16
A7_EXT
  Top 0.406: IC3.13 21.59,21.59 20.32,20.32 8.89,20.32 SV1.29
A8
  Top 0.406: EEPROM.25 113.03,11.43 111.76,12.7 93.98,12.7 92.71,11.43 RAM.25 85.72,11.43 84.45,12.7 64.77,12.7 63.5,13.97 CPU.16 50.16,13.97 48.9,12.7 41.27,12.7 38.73,15.24 34.29,15.24 33.02,16.51 IC3.6
A8_EXT
  Top 0.406: IC3.14 21.59,19.05 20.32,17.78 8.89,17.78 SV1.31
A9  (via drill 0.7)
  Top 0.406: v79.38,16.51 85.09,16.51 87.63,13.97 RAM.24 92.71,13.97 93.98,15.24 111.76,15.24 113.03,13.97 EEPROM.24 | v79.38,5.08 65.41,5.08 62.87,7.62 57.15,7.62 53.34,11.43 CPU.17 50.16,11.43 48.9,10.16 41.27,10.16 38.73,12.7 34.29,12.7 33.02,13.97 IC3.5
  Bottom 0.406: v79.38,16.51 v79.38,5.08
A9_EXT
  Top 0.406: IC3.15 21.59,16.51 20.32,15.24 8.89,15.24 SV1.33
A10  (via drill 0.6, 0.7)
  Top 0.406: EEPROM.21 113.03,21.59 111.76,22.86 v96.52,22.86 93.98,22.86 92.71,21.59 RAM.21 | v96.52,38.1 v53.34,38.1 | IC3.4 33.02,11.43 34.29,10.16 38.73,10.16 41.27,7.62 48.9,7.62 50.16,8.89 CPU.18
  Bottom 0.406: v96.52,22.86 v96.52,38.1 | CPU.18 52.7,8.89 53.34,9.53 v53.34,38.1
A10_EXT
  Top 0.406: SV1.35 8.89,12.7 20.32,12.7 21.59,13.97 IC3.16
A11  (via drill 0.7)
  Top 0.406: EEPROM.23 113.03,16.51 111.76,17.78 v99.06,17.78 93.98,17.78 92.71,16.51 RAM.23 | v54.61,40.64 67.94,40.64 68.58,40.01 v99.06,40.01 | IC1.1 46.35,76.83 47.62,75.56 v53.34,75.56 | IC3.3 33.02,8.89 34.29,7.62 38.73,7.62 41.27,5.08 48.9,5.08 50.16,6.35 CPU.19
  Bottom 0.406: v99.06,17.78 v99.06,40.01 | CPU.19 52.7,6.35 54.61,8.26 v54.61,40.64 53.34,41.91 v53.34,75.56
A11_EXT
  Top 0.406: IC3.17 21.59,11.43 20.32,10.16 8.89,10.16 SV1.37
A12  (via drill 0.6)
  Top 0.406: v94.61,6.35 RAM.2 107.95,6.35 109.22,7.62 111.76,7.62 114.3,5.08 127,5.08 128.27,6.35 EEPROM.2 | v94.61,2.54 88.27,2.54 87.63,1.91 85.09,1.91 84.45,2.54 53.98,2.54 52.7,3.81 CPU.20 50.8,3.81 49.53,2.54 41.27,2.54 38.73,5.08 33.66,5.08 32.38,6.35 IC3.2 | IC1.2 46.35,74.3 v47.62,73.03
  Bottom 0.406: v94.61,6.35 v94.61,2.54 | v47.62,73.03 47.62,8.89 CPU.20
A12_EXT
  Top 0.406: IC3.18 21.59,8.89 19.68,6.99 9.53,6.99 SV1.39
A13  (via drill 0.6, 0.7)
  Top 0.406: v82.55,8.89 RAM.26 92.71,8.89 93.98,10.16 111.76,10.16 113.03,8.89 EEPROM.26 | v82.55,3.81 v72.39,3.81 CPU.21 | IC6.4 33.66,66.67 34.92,67.94 39.37,67.94 43.18,71.75 IC1.3 48.26,71.75 49.53,73.03 55.24,73.03 v55.88,72.39 | v55.88,45.72 70.48,45.72 v72.39,43.81
  Bottom 0.406: v82.55,3.81 v82.55,8.89 | v72.39,3.81 v72.39,43.81 | v55.88,72.39 v55.88,45.72
A14  (via drill 0.6, 0.7)
  Top 0.406: CPU.22 v71.12,6.35 87,6.35 88.27,5.08 102.87,5.08 104.14,3.81 RAM.1 | IC2.14 65.41,70.48 48.26,70.48 46.99,69.22 IC1.4 | EEPROM.1 118.75,3.81 116.84,1.91 v112.39,1.91
  Bottom 0.406: v71.12,6.35 71.12,69.22 68.58,71.75 IC2.14 | v112.39,1.91 109.22,1.91 107.31,3.81 RAM.1
A15  (via drill 0.6, 0.7)
  Top 0.406: CPU.23 v69.85,8.89 | IC1.6 44.45,64.14 48.26,67.94 65.41,67.94 IC2.13 | v69.85,26.67 79.38,26.67 81.92,24.13 RAM.20
  Bottom 0.406: IC2.13 67.94,69.22 69.85,67.31 v69.85,26.67 v69.85,8.89
CTS
  Top 0.406: TRANSCEIVER.13 116.84,79.38 118.11,80.64 SV2.6
D0  (via drill 0.6, 0.7)
  Top 0.406: EEPROM.11 128.27,29.21 127,27.94 113.03,27.94 111.76,29.21 RAM.11 93.98,29.21 92.71,27.94 81.28,27.94 v80.01,29.21 CPU.31 | IC5.18 48.9,21.59 50.16,22.86 v59.05,22.86
  Bottom 0.406: UART.1 v80.01,29.21 | v59.05,22.86 65.41,29.21 CPU.31
D0_EXT
  Top 0.406: SV1.26 20.32,26.67 21.59,27.94 26.04,27.94 28.57,25.4 33.02,25.4 34.29,24.13 IC5.2
D1  (via drill 0.6)
  Top 0.406: EEPROM.12 128.27,31.75 127,30.48 113.03,30.48 111.76,31.75 RAM.12 93.98,31.75 92.71,30.48 v82.55,30.48 v68.58,30.48 | IC5.17 48.9,19.05 50.16,20.32 v59.05,20.32
  Bottom 0.406: v82.55,30.48 UART.2 | v68.58,30.48 68.58,27.94 67.31,26.67 CPU.30 65.41,26.67 v59.05,20.32
D1_EXT
  Top 0.406: SV1.28 20.32,24.13 21.59,25.4 26.04,25.4 28.57,22.86 33.02,22.86 34.29,21.59 IC5.3
D2  (via drill 0.6, 0.7)
  Top 0.406: EEPROM.13 128.27,34.29 127,33.02 113.03,33.02 111.76,34.29 RAM.13 93.34,34.29 92.08,33.02 v86.36,33.02 | CPU.29 79.38,24.13 81.92,21.59 v86.36,21.59 | IC5.16 48.9,16.51 50.16,17.78 v59.05,17.78
  Bottom 0.406: UART.3 85.09,38.1 86.36,36.83 v86.36,33.02 v86.36,21.59 | v59.05,17.78 65.41,24.13 CPU.29
D2_EXT
  Top 0.406: SV1.30 20.32,21.59 21.59,22.86 26.04,22.86 28.57,20.32 33.02,20.32 34.29,19.05 IC5.4
D3  (via drill 0.6, 0.7)
  Top 0.406: EEPROM.15 113.03,36.83 111.76,38.1 103.5,38.1 102.23,36.83 RAM.15 v78.11,36.83 | CPU.28 v78.11,21.59 | IC5.15 48.9,13.97 50.16,15.24 v59.05,15.24
  Bottom 0.406: RAM.15 87.63,39.37 UART.4 | v78.11,21.59 v78.11,36.83 | v59.05,15.24 65.41,21.59 CPU.28
D3_EXT
  Top 0.406: SV1.32 20.32,19.05 21.59,20.32 26.04,20.32 28.57,17.78 33.02,17.78 34.29,16.51 IC5.5
D4  (via drill 0.6, 0.7)
  Top 0.406: EEPROM.16 113.03,34.29 111.76,35.56 93.34,35.56 92.08,34.29 RAM.16 v76.2,34.29 | v76.2,19.05 CPU.27 | IC5.14 48.9,11.43 50.16,12.7 v59.05,12.7
  Bottom 0.406: v76.2,34.29 v76.2,19.05 | UART.5 90.17,41.27 92.08,39.37 92.08,36.2 RAM.16 | v59.05,12.7 65.41,19.05 CPU.27
D4_EXT
  Top 0.406: SV1.34 20.32,16.51 21.59,17.78 26.04,17.78 28.57,15.24 33.02,15.24 34.29,13.97 IC5.6
D5  (via drill 0.6, 0.7)
  Top 0.406: EEPROM.17 113.03,31.75 111.76,33.02 v93.98,33.02 92.71,31.75 RAM.17 v74.3,31.75 | CPU.26 v74.3,16.51 | IC5.13 48.9,8.89 50.16,10.16 52.7,10.16 56.52,6.35 v61.59,6.35
  Bottom 0.406: UART.6 92.71,41.27 93.98,40.01 v93.98,33.02 | v74.3,31.75 v74.3,16.51 | v61.59,6.35 61.59,12.7 65.41,16.51 CPU.26
D5_EXT
  Top 0.406: SV1.36 20.32,13.97 21.59,15.24 26.04,15.24 28.57,12.7 33.02,12.7 34.29,11.43 IC5.7
D6  (via drill 0.6, 0.7)
  Top 0.406: EEPROM.18 113.03,29.21 111.76,30.48 v95.25,30.48 93.98,30.48 92.71,29.21 RAM.18 v84.45,29.21 | v84.45,13.97 CPU.25 | IC5.12 48.9,6.35 50.16,7.62 52.7,7.62 55.24,5.08 v62.87,5.08
  Bottom 0.406: v84.45,29.21 v84.45,13.97 | UART.7 v95.25,30.48 | CPU.25 65.41,13.97 62.87,11.43 v62.87,5.08
D6_EXT
  Top 0.406: SV1.38 20.32,11.43 21.59,12.7 26.04,12.7 28.57,10.16 33.02,10.16 34.29,8.89 IC5.8
D7  (via drill 0.6, 0.7)
  Top 0.406: EEPROM.19 113.03,26.67 111.76,27.94 v97.79,27.94 93.98,27.94 92.71,26.67 RAM.19 v82.55,26.67 | CPU.24 v82.55,11.43 | v64.14,3.81 53.98,3.81 52.7,5.08 50.16,5.08 48.9,3.81 IC5.11
  Bottom 0.406: v82.55,26.67 v82.55,11.43 | UART.8 v97.79,27.94 | CPU.24 65.41,11.43 64.14,10.16 v64.14,3.81
D7_EXT
  Top 0.406: SV1.40 20.32,8.89 21.59,10.16 26.04,10.16 28.57,7.62 33.02,7.62 34.29,6.35 IC5.9
E  (via drill 0.6)
  Top 0.406: TP12.TP CPU.34 v62.23,36.83 | IC4.9 32.38,52.07 34.92,54.61 v62.23,54.61
  Bottom 0.406: v62.23,36.83 v62.23,54.61 62.23,68.58 IC2.3
E_EXT
  Top 0.406: IC4.11 21.59,54.61 20.32,53.34 8.89,53.34 SV1.3
GND
  pour Bottom: 0.64,100.97 139.06,100.97 139.06,0.64 0.64,0.64
N$1
  Top 0.406: TP10.TP QG2.8
  Bottom 0.406: QG2.8 98.42,67.94 106.05,60.33 113.67,60.33 114.3,59.69 114.3,55.88 118.11,52.07 UART.16
N$2  (via drill 0.7)
  Top 0.406: v118.75,60.33 101.6,60.33 100.33,59.05 UART.32
  Bottom 0.406: TRANSCEIVER.11 121.92,75.56 120.65,74.3 120.65,62.23 v118.75,60.33
N$3
  Top 1.016: IC7.1 19.05,66.67 D1.C C11.+
N$4
  Top 0.406: IC6.8 34.92,59.05 29.84,64.14 IC6.5
N$5
  Top 1.016: S1.P$1 15.57,85.09 CN1.TIP
N$6  (via drill 0.7)
  Top 0.406: UART.11 105.41,43.81 106.68,45.09 109.22,45.09 111.76,47.62 v121.92,47.62 | TRANSCEIVER.10 127,78.74 JP3.2
  Bottom 0.406: v121.92,47.62 121.92,59.05 125.73,62.23 125.73,71.75 124.46,73.03 TRANSCEIVER.10
N$7  (via drill 0.7)
  Top 0.406: v114.94,61.59 99.06,61.59 97.79,60.33 91.44,60.33 90.17,59.05 UART.36
  Bottom 0.406: TRANSCEIVER.12 119.38,74.93 115.57,71.12 115.57,62.23 v114.94,61.59
N$8
  Top 0.406: SV2.9 113.03,86.56 COM.4
N$9
  Top 0.406: TRANSCEIVER.1 109.22,64.77 C14.1
N$10
  Top 0.406: TRANSCEIVER.3 114.3,64.77 C14.2
N$11  (via drill 0.7)
  Top 0.406: v124.46,49.53 111.12,49.53 107.95,46.35 105.41,46.35 102.87,43.81 UART.10 | JP3.3 TRANSCEIVER.9
  Bottom 0.406: TRANSCEIVER.9 127,74.3 128.27,73.03 128.27,62.87 124.46,59.69 v124.46,49.53
N$12
  Top 0.406: TRANSCEIVER.4 C13.1
N$13  (via drill 0.6)
  Top 0.406: CPU.38 TP11.TP v72.39,46.99
  Bottom 0.406: QG1.8 83.19,69.85 80.64,67.31 76.83,67.31 73.66,64.14 73.66,48.26 v72.39,46.99
N$14
  Top 0.406: TRANSCEIVER.5 C13.2
N$15
  Bottom 1.016: S1.P$2 22.86,78.11 D1.A
N$16
  Top 0.406: SV2.1 123.19,86.56 COM.2
N$17
  Top 0.406: SV2.5 118.11,85.72 116.84,87 116.84,91.34 COM.8
N$18
  Bottom 0.406: SV2.7 116.2,85.09 119.38,88.27 119.38,91.34 COM.7
N$19
  Top 0.406: TRANSCEIVER.2 111.76,69.22 110.49,70.48 107.95,70.48 106.68,69.22 C16.1
N$20
  Top 0.406: SV2.3 120.65,86.36 COM.3
N$21
  Top 0.406: TRANSCEIVER.6 121.92,66.67 C15.2
N$22
  Top 0.406: R7.2 86.36,66.04 85.72,66.67 82.55,66.67 81.92,66.04 T1.B
N$23
  Bottom 0.406: R7.1 99.69,64.14 105.41,58.42 UART.30
N$24
  Top 0.406: SV2.10 114.3,83.82 124.46,83.82 125.09,84.45 125.09,90.17 123.83,91.44 COM.6
N$25
  Top 0.406: EEPROM.27 127,6.35 128.27,7.62 132.72,7.62 133.99,8.89 133.99,13.97 134.62,14.61 JP2.2
N$26  (1 unrouted)
  Top 1.016: JP1.1 20.32,79.38 16.51,75.56 IC7.3
N$27
  Top 0.406: UART.9 100.33,41.91 101.6,40.64 114.3,40.64 115.57,41.91 UART.15
R/!W  (via drill 0.6)
  Top 0.406: v59.05,25.4 40.64,25.4 39.37,26.67 IC5.1
  Bottom 0.406: IC2.2 63.5,69.85 63.5,33.66 65.41,31.75 | 65.41,31.75 v59.05,25.4 | 65.41,31.75 CPU.32
RTS
  Top 0.406: TRANSCEIVER.14 114.3,79.38 115.57,80.64 SV2.8
RXD
  Bottom 0.406: TRANSCEIVER.8 127,72.39 125.73,73.66 125.73,80.01 SV2.2
TXD
  Bottom 0.406: TRANSCEIVER.7 124.46,71.12 123.19,72.39 123.19,80.01 SV2.4
VCC  (via drill 0.7)  (2 unrouted)
  Top 0.406: CPU.7 55.24,36.83 57.78,34.29 CPU.33 | UART.12 UART.13 110.49,43.81 111.76,45.09 130.81,45.09 | UART.40 UART.39 | 104.14,62.87 C16.2
  Top 1.016: 78.11,61.59 75.56,61.59 C6.+ | 78.11,61.59 80.01,59.69 UART.40 | EEPROM.28 110.87,3.81 C5.+ 107.57,1.91 104.14,1.91 101.6,3.81 RAM.28 C3.+ | 78.11,61.59 97.16,61.59 98.42,62.87 104.14,62.87 104.14,69.22 107.31,72.39 109.22,72.39 | 109.22,72.39 TRANSCEIVER.16 C4.+ 105.03,78.49 103.5,80.01 98.42,80.01 | v127,38.1 130.81,41.91 130.81,45.09 130.81,69.85 128.27,72.39 109.22,72.39 | IC1.16 51.44,80.01 66.67,80.01 | 66.67,80.01 IC2.16 | 66.67,80.01 83.19,80.01 | 83.19,80.01 98.42,80.01 | QG1.14 83.19,80.01 | QG2.14 98.42,80.01 | CPU.7 43.81,36.83 | 43.81,36.83 37.47,36.83 R1.2 | C2.+ 43.81,36.83 | C10.+ 51.05,80.01 39.75,80.01 C9.+ 38.35,79.38 JP1.2 | IC4.20 22.86,31.75 20.95,29.84 C17.+ | C8.+ IC3.20
  Bottom 0.406: 127,14.61 127.64,15.24 132.08,15.24 133.99,17.14 JP2.1 | 67.31,34.29 CPU.33 65.41,34.29 64.77,34.92 64.77,41.27 65.41,41.91 CPU.36
  Bottom 1.016: EEPROM.28 116.2,3.81 127,14.61 v127,38.1 | R2.2 R3.2 R4.2 R5.2 R1.2 36.2,33.02 33.02,29.84 26.67,29.84 24.77,31.75 IC4.20 | IC5.20 C2.+ | 39.37,74.3 39.37,56.52 R2.2 | IC6.14 39.37,74.3 | C17.+ C8.+ | C9.+ 39.37,74.3 | R2.2 36.2,53.98 33.66,56.52 20.07,56.52 C7.+ 10.54,60.07 SV1.1

### Text on the board
tNames: 6809 Mainboard / Rev 1.99 | (C) 2014 Travis Geiselbrecht / geist@foobox.com | GND | TX | RX | UARTCLK | !IOSEL | VCC | GND | !ROMSEL | E | !EIO0 | !RD | !EIO1 | !WR | !WR | !EIO2 | !RD | !EIO3 | CLK | !IRQ | !FIQ | A0 | A1 | E | A2 | A3 | A4 | A5 | D0 | A6 | D1 | A7 | D2 | A8 | A8 | D3 | !WE! / Enable | A9 | D4 | A10 | D5 | A11 | D6 | A12 | D7